# Altium project MachXO2FPGA.PrjPcb
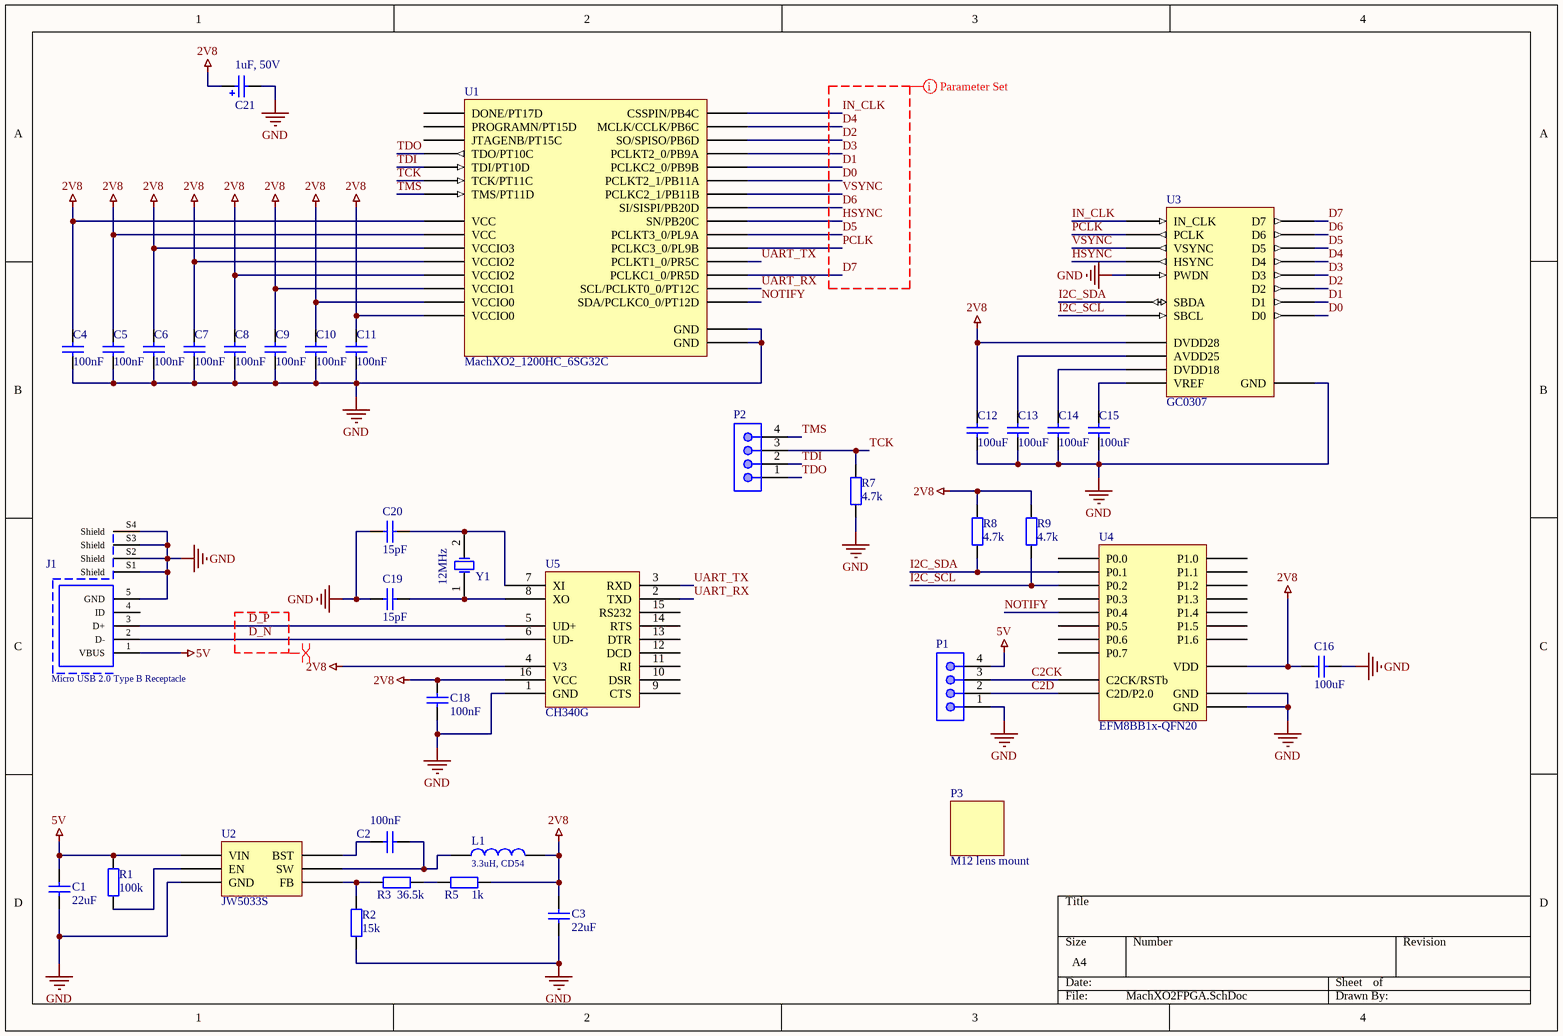
[diagram p0: MachXO2FPGA.SchDoc]
1 sheet, 38 parts. Net scope: global (net labels, ports and power ports of the same name join across sheets).
Board file: MachXO2FPGA.PcbDoc

## Sheet MachXO2FPGA.SchDoc
size A4

### Parts
C1  22uF  [WCAP-CSGP_0805_H=0.8mm_Reflow]
C2  100nF  [WCAP-CSGP_0805_H=0.8mm_Reflow]
C3  22uF  [WCAP-CSGP_0805_H=0.8mm_Reflow]
C4  100nF  [WCAP-CSGP_0805_H=0.8mm_Reflow]
C5  100nF  [WCAP-CSGP_0805_H=0.8mm_Reflow]
C6  100nF  [WCAP-CSGP_0805_H=0.8mm_Reflow]
C7  100nF  [WCAP-CSGP_0805_H=0.8mm_Reflow]
C8  100nF  [WCAP-CSGP_0805_H=0.8mm_Reflow]
C9  100nF  [WCAP-CSGP_0805_H=0.8mm_Reflow]
C10  100nF  [WCAP-CSGP_0805_H=0.8mm_Reflow]
C11  100nF  [WCAP-CSGP_0805_H=0.8mm_Reflow]
C12  100uF  [WCAP-CSGP_0805_H=0.8mm_Reflow]
C13  100uF  [WCAP-CSGP_0805_H=0.8mm_Reflow]
C14  100uF  [WCAP-CSGP_0805_H=0.8mm_Reflow]
C15  100uF  [WCAP-CSGP_0805_H=0.8mm_Reflow]
C16  100uF  [WCAP-CSGP_0805_H=0.8mm_Reflow]
C18  100nF  [WCAP-CSGP_0805_H=0.8mm_Reflow]
C19  15pF  [WCAP-CSGP_0805_H=0.6mm_Reflow]
C20  15pF  [WCAP-CSGP_0805_H=0.6mm_Reflow]
C21  1uF, 50V  [WCAP-ATG8_5x11]
J1  Micro USB 2.0 Type B Receptacle  [629105136821]
L1  3.3uH, CD54  [WE-PD2_5848]
P1  (no value)  [61300411021]
P2  (no value)  [61300411021]
P3  M12 lens mount  [PCBComponent_1]
R1  100k  [WRIS-PSMB_0805_H=0.22mm]
R2  15k  [WRIS-PSMB_0805_H=0.22mm]
R3  36.5k  [WRIS-PSMB_0805_H=0.22mm]
R5  1k  [WRIS-PSMB_0805_H=0.22mm]
R7  4.7k  [WRIS-PSMB_0805_H=0.22mm]
R8  4.7k  [WRIS-PSMB_0805_H=0.22mm]
R9  4.7k  [WRIS-PSMB_0805_H=0.22mm]
U1  MachXO2_1200HC_6SG32C  [QFN50P500X500X65_HS-33N]
U2  JW5033S  [SOT95P280X110-6N]
U3  GC0307  [BGA20C60P5X4_329X276X78]
U4  EFM8BB1x-QFN20  [*QFN50P300X300X80-21N]
U5  CH340G  [CH340G]
Y1  12MHz  [WE-XTAL_HC49/4H]

### Nets
2V8: C3.1 C4.1 C5.1 C6.1 C7.1 C8.1 C9.1 C10.1 C11.1 C12.1 C16.1 C18.2 C21.2(P) L1.2 R5.2 R8.2 R9.2 U1.2(VCC) U1.6(VCCIO3) U1.7(VCCIO2) U1.15(VCCIO2) U1.18(VCC) U1.19(VCCIO1) U1.24(VCCIO0) U1.31(VCCIO0) U3.D1(DVDD28) U4.4(VDD) U5.4(V3) U5.16(VCC)
5V: C1.2 J1.1(VBUS) P1.4 R1.2 U2.3(VIN)
GND: C1.1 C3.2 C4.2 C5.2 C6.2 C7.2 C8.2 C9.2 C10.2 C11.2 C12.2 C13.2 C14.2 C15.2 C16.2 C18.1 C19.1 C20.2 C21.1(N) J1.5(GND) J1.S1(Shield) J1.S2(Shield) J1.S3(Shield) J1.S4(Shield) P1.1 R2.1 R7.1 U1.3(GND) U1.22(GND) U2.1(GND) U3.B1(GND) U3.B2(PWDN) U4.3(GND) U4.12(GND) U5.1(GND)
C2CK: P1.3 U4.5(C2CK/RSTb)
C2D: P1.2 U4.6(C2D/P2.0)
D0: U1.13(PCLKT2_1/PB11A) U3.C2(D0)
D1: U1.12(PCLKC2_0/PB9B) U3.D2(D1)
D2: U1.10(SO/SPISO/PB6D) U3.D3(D2)
D3: U1.11(PCLKT2_0/PB9A) U3.C3(D3)
D4: U1.9(MCLK/CCLK/PB6C) U3.C4(D4)
D5: U1.4(PCLKT3_0/PL9A) U3.B5(D5)
D6: U1.17(SI/SISPI/PB20D) U3.B4(D6)
D7: U1.20(PCLKC1_0/PR5D) U3.A5(D7)
D_N: J1.2(D-) U5.6(UD-)
D_P: J1.3(D+) U5.5(UD+)
HSYNC: U1.16(SN/PB20C) U3.B3(HSYNC)
I2C_SCL: R9.1 U3.A4(SBCL) U4.20(P0.2)
I2C_SDA: R8.1 U3.A3(SBDA) U4.1(P0.1)
IN_CLK: U1.8(CSSPIN/PB4C) U3.D5(IN_CLK)
NOTIFY: U1.27(SDA/PCLKC0_0/PT12D) U4.18(P0.4)
PCLK: U1.5(PCLKC3_0/PL9B) U3.C5(PCLK)
TCK: P2.3 R7.2 U1.30(TCK/PT11C)
TDI: P2.2 U1.32(TDI/PT10D)
TDO: P2.1 U1.1(TDO/PT10C)
TMS: P2.4 U1.29(TMS/PT11D)
UART_RX: U1.28(SCL/PCLKT0_0/PT12C) U5.2(TXD)
UART_TX: U1.21(PCLKT1_0/PR5C) U5.3(RXD)
VSYNC: U1.14(PCLKC2_1/PB11B) U3.C1(VSYNC)
NetC2_1: C2.1 L1.1 U2.2(SW)
NetC2_2: C2.2 U2.4(BST)
NetC13_1: C13.1 U3.A1(AVDD25)
NetC14_1: C14.1 U3.D4(DVDD18)
NetC15_1: C15.1 U3.A2(VREF)
NetC19_2: C19.2 U5.8(XO) Y1.1(OSC1)
NetC20_1: C20.1 U5.7(XI) Y1.2(OSC2)
NetR1_1: R1.1 U2.5(EN)
NetR2_2: R2.2 R3.1 U2.6(FB)
NetR3_2: R3.2 R5.1

Not connected (* = marked no-connect by the designer): J1 4(ID); U1 23(DONE/PT17D) 25(PROGRAMN/PT15D) 26(JTAGENB/PT15C); U4 2(P0.0) 7(P1.6) 8(P1.5) 9(P1.4) 10(P1.3) 11(P1.2) 13(P1.1) 14(P1.0) 15(P0.7) 16(P0.6) 17(P0.5) 19(P0.3); U5 9(CTS) 10(DSR) 11(RI) 12(DCD) 13(DTR) 14(RTS) 15(RS232)

### Layout directives
net class IMG_SENS; rule Differential Pairs Routing [Pref Gap = 3.5mil    Min Gap  = 3.5mil    Max Gap  = 50milPref Width = 3.5mil    Min Width  = 3.5mil    Max Width  = 12mil]: D0, D1, D2, D3, D4, D5, D6, D7, HSYNC, IN_CLK, PCLK, VSYNC
differential pair; net class USB; rule Differential Pairs Routing [Pref Gap = 5mil    Min Gap  = 3.5mil    Max Gap  = 50milPref Width = 7.346mil    Min Width  = 3.5mil    Max Width  = 12mil]: D_N, D_P

### Library data of the parts
C1-C16 C18 = 885012207016: WCAP-CSGP General Purpose Ceramic Capacitors, size 0805, 100nF, +/-10%, 10VDC; Isolation Resistance: >=5GOhm; Ceramic Type: X7R; Technical Reference: X7R0805104K010DFCT10000; ComponentLink1Description: Manufacturer; ComponentLink1URL: http://www.we-online.de; ComponentLink2Description: Datasheet; ComponentLink2URL: https://katalog.we-online.com/pbs/datasheet/885012207016.pdf; Operating Temperature: -55 to +125degC; Packaging: Tape and Reel; Part Number: 885012207016; Publisher: Wurth Elektronik; Rated Voltage: 10VDC; Published Date: August 2019; Capacitance Tolerance: +/-10%; Dissipation Factor: =<5%; Height: 0.8mm +/-0.10mm; Mounting Technology: SMD; Size: 0805; Capacitance: 100nF
C19 C20 = 885012007001: WCAP-CSGP General Purpose Ceramic Capacitors, size 0805, 15pF, +/-5%, 10VDC; Isolation Resistance: >=10GOhm; Ceramic Type: NP0; Dissipation Factor: Q>=400+20C; Technical Reference: NP00805150J010DFCT10000; ComponentLink1Description: Manufacturer; ComponentLink1URL: http://www.we-online.de; ComponentLink2Description: Datasheet; ComponentLink2URL: https://katalog.we-online.com/pbs/datasheet/885012007001.pdf; Operating Temperature: -55 to +125degC; Packaging: Tape and Reel; Part Number: 885012007001; Publisher: Wurth Elektronik; Rated Voltage: 10VDC; Published Date: August 2019; Capacitance Tolerance: +/-5%; Height: 0.6mm +/-0.10mm; Mounting Technology: SMD; Size: 0805; Capacitance: 15pF
C21 = 860010672005: WCAP-ATG8 THT Aluminum Electrolytic Capacitors, D5mm x L11mm, 1uF, +/-20%, 50VDC; Dissipation Factor: 10%; Endurance: 2000h; Leakage Current: 3uA; Ripple Current max.: 17mA; Technical Reference: ATBC110010M050DSPA3B000; ComponentLink1Description: Manufacturer; ComponentLink1URL: http://www.we-online.de; ComponentLink2Description: Datasheet; ComponentLink2URL: https://katalog.we-online.com/pbs/datasheet/860010672005.pdf; Length: 11mm; Mounting Technology: THT; Operating Temperature: -40 to +85degC; Packaging: Ammo Pack; Published Date: August 2019; Capacitance: 1uF; Diameter: 5mm; Part Number: 860010672005; Publisher: Wurth Elektronik; Capacitance Tolerance: +/-20%; Rated Voltage: 50VDC
J1 = 629105136821: Micro USB 2.0 Type B, Receptacle, Horizontal, SMT; Rated Current: 1A; Pin Number: 5; Interface Type: Type B; Working Voltage: 30VAC; ComponentLink1Description: Manufacturer; ComponentLink1URL: http://www.we-online.de; ComponentLink2Description: Datasheet; ComponentLink2URL: https://katalog.we-online.com/em/datasheet/629105136821.pdf; Published Date: September 2019; Publisher: Wurth Elektronik; Part Number: 629105136821; Gender: Receptacle; Type: Horizontal; Packaging: Tape and Reel; Operating Temperature: -40 to +105degC; Mounting Technology: SMT; Application: Micro USB 2.0
L1 = 744774022: WE-PD2 SMT Power Inductor, size 5848, 2.2uH, 4.6A; Manufacturer: Wurth Elektronik; Self Resonant Frequency: 54MHz; DC Resistance max.: 0.041Ohm; DC Resistance typ.: 0.026Ohm; Saturation Current: 8.2A; ComponentLink1Description: Manufacturer; ComponentLink1URL: http://www.we-online.de; ComponentLink2Description: Datasheet; ComponentLink2URL: https://www.we-online.com/catalog/datasheet/744774022.pdf; Packaging: Tape and Reel; Published Date: April 2020; Rated Current: 4.6A; Operating Temperature: -40 to +125degC; Size: 5848; Inductance: 2.2uH; Mounting Technology: SMT; Manufacturer Part Number: 744774022
P1 P2 = 61300411021: WR-PHD Pin Header, THT, pitch 2.54mm, Single Row, Angled, 4p; Manufacturer: Wurth Elektronik; Pin Number: 4; Rated Current: 3A; Working Voltage: 250VAC; Withstanding Voltage: 500VAC; Contact Resistance: 20mOhm; ComponentLink1Description: Manufacturer; ComponentLink1URL: http://www.we-online.de; ComponentLink2Description: Datasheet; ComponentLink2URL: https://www.we-online.com/catalog/datasheet/61300411021.pdf; Manufacturer Part Number: 61300411021; Published Date: May 2020; Pitch: 2.54mm; Operating Temperature: -40 to +105degC; Mounting Technology: THT; Packaging: Bag; Gender: Pin Header; Row Number: Single; Orientation: Angled
R1-R3 R5 R7-R9 = 580060720008: WRIS-PSMB Metal Plate Resistors, size 0805, 10mOhm, +/-1%, 0.5W; Rated Current: 7.07A; Temperature Coefficient of Resistance: +/-100ppm/degC; Technical Reference: MB0805R010F102KAATP0000; ComponentLink1Description: Manufacturer; ComponentLink1URL: http://www.we-online.de; ComponentLink2Description: Datasheet; ComponentLink2URL: https://katalog.we-online.com/pbs/datasheet/580060720008.pdf; Publisher: Wurth Elektronik; Rated Power: 0.5W; Resistance: 10mOhm; Mounting Technology: SMT; Height: 0.22mm; Part Number: 580060720008; Packaging: Tape and Reel; Published Date: September 2019; Size: 0805; Length: 2mm; Operating Temperature: -55 to +155degC; Resistance Tolerance: +/-1%; Width: 1.25mm
U2 = JW5033S: 2A Step-Down Converter
Y1 = 830014948B: WE-XTAL Quartz Crystal, size HC49 12MHz; Frequency Stability: 50ppm; Frequency Tolerance: +/-30ppm; Frequency: 27.12MHz; ComponentLink1Description: Manufacturer; ComponentLink1URL: http://www.we-online.de; ComponentLink2Description: Datasheet; ComponentLink2URL: https://katalog.we-online.com/pbs/datasheet/830014948B.pdf; Part Number: 830014948B; Published Date: March 2019; Publisher: Wurth Elektronik; Size: HC49-4H; Operating Temperature: -10 up to +60degC; Mounting Technology: THT; Packaging: Bulk; Load Capacitance: -